# Altium schematic sheet out.SchDoc
size A4; SheetNumber: 2; SheetTotal: 2
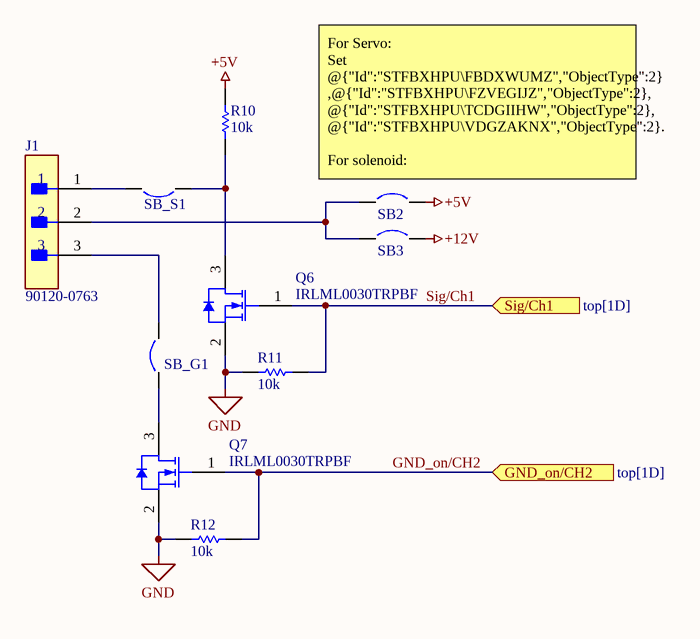
[diagram p0: out.SchDoc]

## Parts
J1  90120-0763  [FP-90120-0763-MFG]
Q6  IRLML0030TRPBF  [INTR-SOT-23-3_V]
Q7  IRLML0030TRPBF  [INTR-SOT-23-3_V]
R10  value 10k  [RESC1609X55X30NL15T15]  (hidden comment: ERJ3EKF1002V)
R11  value 10k  [RESC1609X55X30NL15T15]  (hidden comment: ERJ3EKF1002V)
R12  value 10k  [RESC1609X55X30NL15T15]  (hidden comment: ERJ3EKF1002V)
SB2  (no value)  [JP_SMD]
SB3  (no value)  [JP_SMD]
SB_G1  (no value)  [JP_SMD]
SB_S1  (no value)  [JP_SMD]

## Ports
GND_on/CH2 (in, see top[1D]), Sig/Ch1 (in, see top[1D])

## Nets
+5V: R10.1 SB2.2
+12V: SB3.2
GND: Q6.2(S) Q7.2(S) R11.2 R12.2
GND_on/CH2: Q7.1(G) R12.1 ; port GND_on/CH2
Sig/Ch1: Q6.1(G) R11.1 ; port Sig/Ch1
NetJ1_1: J1.1 SB_S1.2
NetJ1_2: J1.2 SB2.1 SB3.1
NetJ1_3: J1.3 SB_G1.2
NetQ6_3: Q6.3(D) R10.2 SB_S1.1
NetQ7_3: Q7.3(D) SB_G1.1

## Notes on the sheet
- (near SB2) For Servo:
  Set @{"Id":"STFBXHPU\FBDXWUMZ","ObjectType":2} ,@{"Id":"STFBXHPU\FZVEGIJZ","ObjectType":2}, @{"Id":"STFBXHPU\TCDGIIHW","ObjectType":2}, @{"Id":"STFBXHPU\VDGZAKNX","ObjectType":2}.
  For solenoid:
  Set @{"Id":"STFBXHPU\XBSPRXHK","ObjectType":2} ,@{"Id":"STFBXHPU\FZVEGIJZ","ObjectType":2}, @{"Id":"STFBXHPU\TCDGIIHW","ObjectType":2}.
  For led:
  Set @{"Id":"STFBXHPU\FBDXWUMZ","ObjectType":2}, res 150 to @{"Id":"STFBXHPU\FZVEGIJZ","ObjectType":2} and @{"Id":"STFBXHPU\TCDGIIHW","ObjectType":2}.

## Library data of the parts
J1 = CMP-04776-000084-1: CONN HEADER VERT 3POS 2.54MM; Manufacturer: Molex; Voltage Rating: 350V; Number Of Contacts: 3; Conn Orientation: Vertical; Current Rating: 3A; Conn Gender: Male; Package: 90120-0763; ComponentLink2Description: Datasheet; Height: 5.8mm; Manufacturer Part Number: 90120-0763; Temperature Range High: +125°C; RoHS: TRUE; ComponentLink2URL: https://www.molex.com/webdocs/datasheets/pdf/en-us/0901200763_PCB_HEADERS.pdf; Device Class L2: Headers and Wire Housings; Temperature: -55°C to +125°C; Device Class L1: Connectors; Pitch: 2.54mm; Footprint Url: https://www.molex.com/pdm_docs/sd/901200763_sd.pdf; Device Class L3: unset; Temperature Range Low: -55°C; Number Of Rows: 1; Category: Conn; Lead Free: Yes; Mouser Description: Board-To-Board Connector, C-Grid III 90120 Series, Through Hole, Header, 3, 2.54 mm; Octopart: https://octopart.com/90120-0763-molex-655433; Contact Material: Gold,Nickel; Automotive: No; Digikey Description: CONN HEADER VERT 3POS 2.54MM
Q6 Q7 = CMP-2000-06483-1: HEXFET(R) Power MOSFET, 1.3 W, 4.4 ns, -55 to 150 degC, 3-Pin SOT-23, RoHS, Tape and Reel; Manufacturer: International Rectifier; Maximum Drain Source Resistance: 0.027Ω; Transistor Configuration: Single; Channel Mode: Enhancement; Maximum Power Dissipation: 1.3W; Typical Input Capacitance @ Vds: 382pF@15V; Maximum Gate Source Voltage: ±20V; Number of Elements per Chip: 1; Transistor Material: Si; Maximum Gate Threshold Voltage: 2.3V; Typical Turn-On Delay Time: 5.2ns; Maximum Drain Source Voltage: 30V; Typical Turn-Off Delay Time: 7.4ns; Minimum Gate Threshold Voltage: 1.3V; Channel Type: N; Typical Gate Charge @ Vgs: 2.6nC@4.5V; Maximum Continuous Drain Current: 5.3A; Pin Count: 3; Mounting Technology: SurfaceMount; Datasheet URL: https://datasheet.ciiva.com/4442/irlml0030pbf-90019-4442451.pdf; Datasheet Version: 02/2012; Maximum Operating Temperature: +150°C; Category: PowerMOSFET; Package Description: 3-Pin Small Outline Transistor, Body 2.92 x 1.3 mm, Pitch 0.95 mm; Manufacturer URL: http://internationalrectifier.com/; Height: 1.02mm; Minimum Operating Temperature: -55°C; Dimensions: 3.04x1.4x1.02mm; Package Reference: SOT-23-3; Package Type: SOT-23; Mounting Type: SurfaceMount; Length: 3.04mm; Width: 1.4mm
R10-R12 = CMP-1012-00623-3: Chip Resistor, 10 KOhm, +/- 1%, 0.1 W, -55 to 155 degC, 0603 (1608 Metric), RoHS, Tape and Reel; Manufacturer: Panasonic; Voltage Rating: 75V; Case\/Package: 0603; Power Rating: 100mW; Resistance: 10KOhm; Temperature Coefficient: 100ppm\/degreesC; Number of Pins: 2; Package Reference: 603; Depth: 0.8mm; Mount: SurfaceMount; Package Description: 2-Pin Surface Mount Device, Body 1.6 x 0.85 mm; Datasheet Version: 02/2017; Length: 1.6mm; Lead Free: LeadFree; Height: 0.45mm; Number of Terminations: 2; Max Power Dissipation: 100mW; Min Operating Temperature: -55degC; Datasheet URL: https://industrial.panasonic.com/cdbs/www-data/pdf/RDA0000/AOA0000C304.pdf; Termination: SMD/SMT; Case Code (Metric): 1608; Case Code (Imperial): 0603; Tolerance: 1%; Max Operating Temperature: 155degC; RoHSCompliant: true; Voltage Rating (DC): 75V; Radiation Hardening: No; Packaging: TapeandReel; Composition: ThickFilm; Mounting Technology: SurfaceMount; Manufacturer URL: http://www.panasonic.com/; Width: 0.031inch; REACH SVHC: NoSVHC; Contact Plating: Tin; Military Standard: Not; Package Quantity: 1
SB2 SB3 SB_G1 SB_S1 = Circuit Breaker: Solder: NO; Published: 24-Mar-1999; Revision: July-2002: Re-released for DXP Platform.; Publisher: Altium Limited